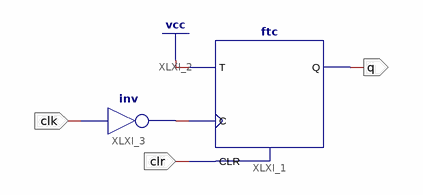
[diagram p0: schematic sheet 1]
// Xilinx ISE schematic TF_fall.sch (spartan6) as structural Verilog: 2 symbols, 3 ports
module TF_fall (
  input  clr,
  input  clk,
  output q
);

  wire XLXN_2;

  ftc XLXI_1 (.C(XLXN_2), .CLR(clr), .T(1'b1), .Q(q));
  not XLXI_3 (XLXN_2, clk);
endmodule
